# EAGLE design unoplustest (EAGLE 9.6.2)
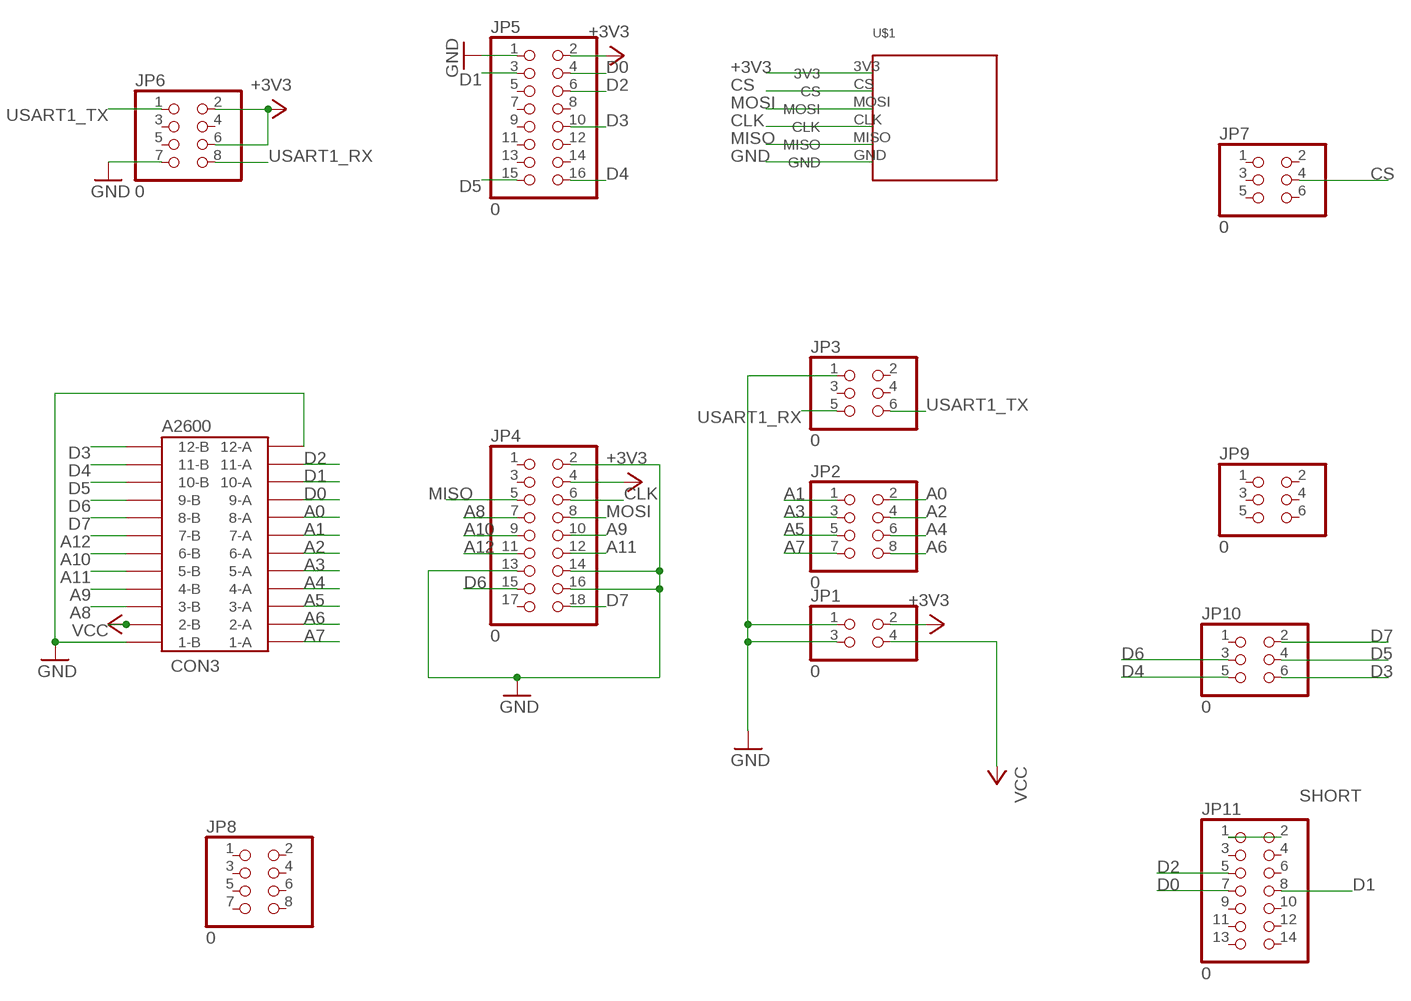
[diagram p0: schematic, sheet 1]

## Parts
CON3  A2600  24PINEDGE-254MM  [24PINEDGE-254MM]
JP1  0  PINHD-2X2  [2X02]
JP2  0  PINHD-2X4  [2X04]
JP3  0  PINHD-2X3  [2X03]
JP4  0  PINHD-2X9  [2X09]
JP5  0  PINHD-2X8  [2X08]
JP6  0  PINHD-2X4  [2X04]
JP7  0  PINHD-2X3  [2X03]
JP8  0  PINHD-2X4  [2X04]
JP9  0  PINHD-2X3  [2X03]
JP10  0  PINHD-2X3  [2X03]
JP11  0  PINHD-2X7  [2X07]
U$1  MICROSD2MICROSD2  [MICROSD_FOOTPRINT]

## Nets
+3V3: JP1.2 JP4.4 JP5.2 JP6.2 JP6.6 U$1.3V3
A0: CON3.8-A JP2.2
A1: CON3.7-A JP2.1
A2: CON3.6-A JP2.4
A3: CON3.5-A JP2.3
A4: CON3.4-A JP2.6
A5: CON3.3-A JP2.5
A6: CON3.2-A JP2.8
A7: CON3.1-A JP2.7
A8: CON3.3-B JP4.7
A9: CON3.4-B JP4.10
A10: CON3.6-B JP4.9
A11: CON3.5-B JP4.12
A12: CON3.7-B JP4.11
CLK: JP4.6 U$1.CLK
CS: JP7.4 U$1.CS
D0: CON3.9-A JP5.4 JP11.7
D1: CON3.10-A JP5.3 JP11.8
D2: CON3.11-A JP5.6 JP11.5
D3: CON3.12-B JP5.10 JP10.6
D4: CON3.11-B JP5.16 JP10.5
D5: CON3.10-B JP5.15 JP10.4
D6: CON3.9-B JP4.15 JP10.3
D7: CON3.8-B JP4.18 JP10.2
GND: CON3.1-B CON3.12-A JP1.1 JP1.3 JP3.1 JP4.2 JP4.13 JP4.14 JP4.16 JP5.1 JP6.7 U$1.GND
MISO: JP4.5 U$1.MISO
MOSI: JP4.8 U$1.MOSI
SHORT: JP11.1 JP11.2
USART1_RX: JP3.5 JP6.8
USART1_TX: JP3.6 JP6.1
VCC: CON3.2-B JP1.4
Unconnected: JP3.2 JP3.3 JP3.4 JP4.1 JP4.3 JP4.17 JP5.5 JP5.7 JP5.8 JP5.9 JP5.11 JP5.12 JP5.13 JP5.14 JP6.3 JP6.4 JP6.5 JP7.1 JP7.2 JP7.3 JP7.5 JP7.6 JP8.1 JP8.2 JP8.3 JP8.4 JP8.5 JP8.6 JP8.7 JP8.8 JP9.1 JP9.2 JP9.3 JP9.4 JP9.5 JP9.6 JP10.1 JP11.3 JP11.4 JP11.6 JP11.9 JP11.10 JP11.11 JP11.12 JP11.13 JP11.14

## Library data of the parts
CON3 = con-edge:24PINEDGE-254MM: 24 PIN EDGE CONNECTOR 2.54mm ATARI 2600 CARTRIDGE PORT
JP1 = pinhead:PINHD-2X2: PIN HEADER
JP2 JP6 JP8 = pinhead:PINHD-2X4: PIN HEADER
JP3 JP7 JP9 JP10 = pinhead:PINHD-2X3: PIN HEADER
JP4 = pinhead:PINHD-2X9: PIN HEADER
JP5 = pinhead:PINHD-2X8: PIN HEADER
JP11 = pinhead:PINHD-2X7: PIN HEADER
U$1 = MICROSD:MICROSD2

## Board
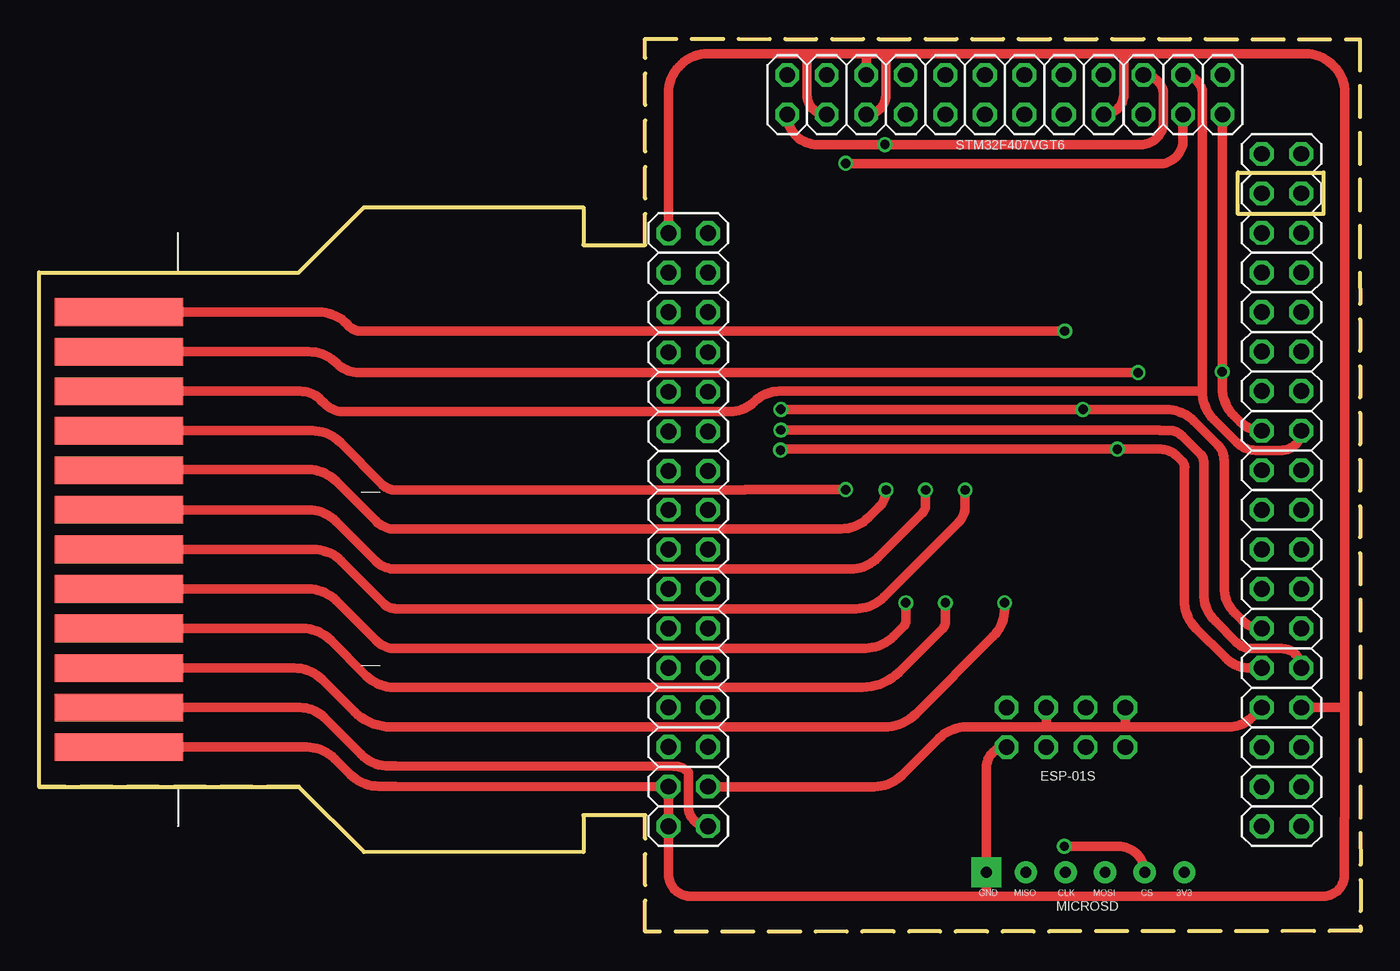
[diagram p1: board, top side]
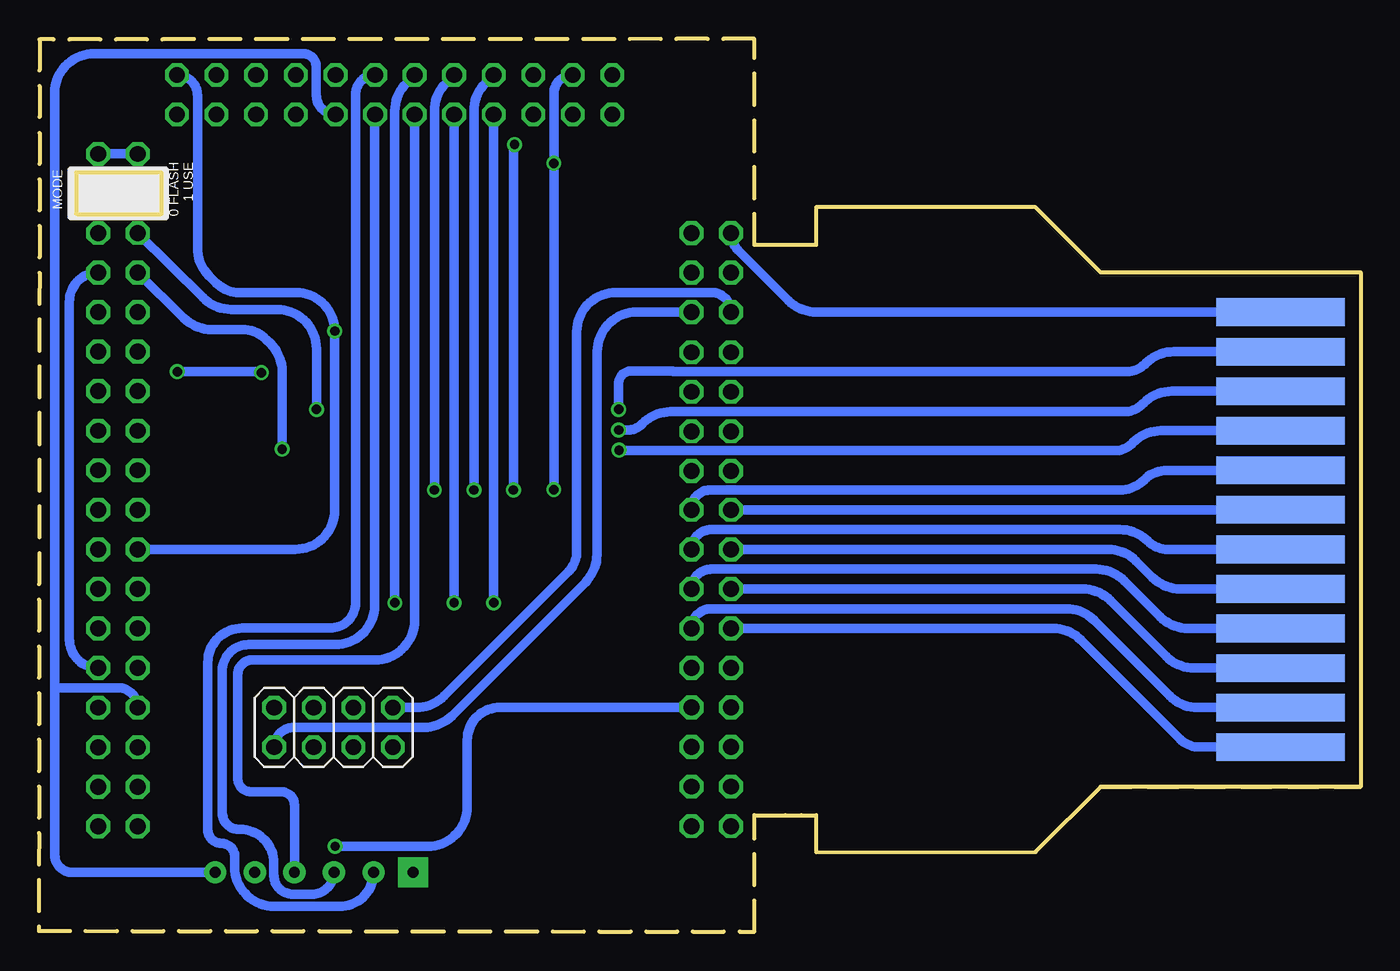
[diagram p2: board, bottom side, seen from below]

Size 84.89 x 57.35 mm. Coordinates in mm from the lower left corner, seen from the top.
Outline: 38.94,7.49 34.98,7.49
Outline: 34.98,7.49 34.98,5.11 20.88,5.13 16.69,9.32
Outline: 0,9.32 0,42.34 16.69,42.34 20.88,46.53 34.98,46.53 34.98,44.12 38.94,44.12 38.94,57.35 84.84,57.33 84.89,0.05 38.94,0 38.94,7.49
Outline: 0,9.32 16.69,9.32
Outline: 38.94,7.49 34.98,7.49
Outline: 16.69,9.32 0,9.32
Copper layers (1*16): Top 0.0356mm / dielectric 1.5011mm / Bottom 0.0356mm
Design rules "OSHPark2layer": minimum track width 6mil, minimum drill 13mil, track to track 6mil, track to pad 6mil, pad to pad 6mil, via to via 6mil, smd to smd 6mil, copper to edge 15mil, drill to drill 6mil, minimum pad ring 7mil, minimum via ring 7mil, stop-mask expansion 3mil, vias tented up to drill 0mil, thermal gap 10mil
tRestrict: area 74.5,2.2 to 74.5,8.7
Milling: 4 lines

### Footprints (pad centres in the part's own frame; a part is rotated, then mirrored left to right if it is on the bottom)
24PINEDGE-254MM = smd 1.778 x 8.255: 1-A -22.86,-7.62; 2-A -20.32,-7.62; 3-A -17.78,-7.62; 4-A -15.24,-7.62; 5-A -12.7,-7.62; 6-A -10.16,-7.62; 7-A -7.62,-7.62; 8-A -5.08,-7.62; 9-A -2.54,-7.62; 10-A 0,-7.62; 11-A 2.54,-7.62; 12-A 5.08,-7.62 | smd 1.778 x 8.255 bottom: 1-B -22.86,-7.62; 2-B -20.32,-7.62; 3-B -17.78,-7.62; 4-B -15.24,-7.62; 5-B -12.7,-7.62; 6-B -10.16,-7.62; 7-B -7.62,-7.62; 8-B -5.08,-7.62; 9-B -2.54,-7.62; 10-B 0,-7.62; 11-B 2.54,-7.62; 12-B 5.08,-7.62
2X02 = drill 1.016 octagon: 1 -1.27,-1.27; 2 -1.27,1.27; 3 1.27,-1.27; 4 1.27,1.27
2X04 = drill 1.016 octagon: 1 -3.81,-1.27; 2 -3.81,1.27; 3 -1.27,-1.27; 4 -1.27,1.27; 5 1.27,-1.27; 6 1.27,1.27; 7 3.81,-1.27; 8 3.81,1.27
2X03 = drill 1.016 octagon: 1 -2.54,-1.27; 2 -2.54,1.27; 3 0,-1.27; 4 0,1.27; 5 2.54,-1.27; 6 2.54,1.27
2X09 = drill 1.016 octagon: 1 -10.16,-1.27; 2 -10.16,1.27; 3 -7.62,-1.27; 4 -7.62,1.27; 5 -5.08,-1.27; 6 -5.08,1.27; 7 -2.54,-1.27; 8 -2.54,1.27; 9 0,-1.27; 10 0,1.27; 11 2.54,-1.27; 12 2.54,1.27; 13 5.08,-1.27; 14 5.08,1.27; 15 7.62,-1.27; 16 7.62,1.27; 17 10.16,-1.27; 18 10.16,1.27
2X08 = drill 1.016 octagon: 1 -8.89,-1.27; 2 -8.89,1.27; 3 -6.35,-1.27; 4 -6.35,1.27; 5 -3.81,-1.27; 6 -3.81,1.27; 7 -1.27,-1.27; 8 -1.27,1.27; 9 1.27,-1.27; 10 1.27,1.27; 11 3.81,-1.27; 12 3.81,1.27; 13 6.35,-1.27; 14 6.35,1.27; 15 8.89,-1.27; 16 8.89,1.27
2X07 = drill 1.016 octagon: 1 -7.62,-1.27; 2 -7.62,1.27; 3 -5.08,-1.27; 4 -5.08,1.27; 5 -2.54,-1.27; 6 -2.54,1.27; 7 0,-1.27; 8 0,1.27; 9 2.54,-1.27; 10 2.54,1.27; 11 5.08,-1.27; 12 5.08,1.27; 13 7.62,-1.27; 14 7.62,1.27
MICROSD_FOOTPRINT = drill 0.7 pad 1.422: 3V3 -13.97,6.35; CLK -13.97,-1.27; CS -13.97,3.81; MISO -13.97,-3.81; MOSI -13.97,1.27 | drill 0.7 pad 1.93 square: GND -13.97,-6.35

### Placement (x,y rotation side)
CON3  12.75,34.72 90 bottom
JP1  41.71,8.05 270 top
JP2  41.71,23.29 270 top
JP3  41.71,42.34 270 top
JP4  58.22,53.77 180 top
JP5  79.81,23.29 90 top
JP6  65.96,13.13 0 bottom
JP7  41.71,14.41 270 top
JP8  41.71,33.41 270 top
JP9  79.81,9.31 270 top
JP10  73.48,53.77 0 top
JP11  79.81,42.35 270 top
U$1  67.21,-10.16 270 top

### Tracks (layer width: path | path; a pad name or v marks a point on that pad's centre or on a via)
+3V3
  Top 0.61: JP1.2 53.66,9.32 arc45 55.44,10.06 57.8,12.41 arc-45 59.59,13.16 64.67,13.16 | 64.67,13.16 69.77,13.16 | 69.77,13.16 76.43,13.16 arc45 77.9,13.77 JP5.2 | JP6.2 69.77,13.16 | JP6.6 64.69,13.22 arc-45 64.67,13.16
  Bottom 0.61: JP4.4 arc90 67.07,53.73 67.07,55.55 arc-90 67.94,56.42 81.33,56.42 arc-90 83.87,53.88 83.87,15.67 | 83.87,15.67 83.87,10.42 arc90 83.87,10.41 83.87,4.95 arc-90 82.73,3.81 U$1.3V3 | JP5.2 arc-90 79.81,15.67 83.87,15.67
A0
  Bottom 0.61: JP2.2 42.98,27.17 arc90 41.77,28.38 15.47,28.38 arc-45 13.89,29.03 arc45 12.42,29.64 CON3.8-A
A1
  Bottom 0.61: JP2.1 CON3.7-A
A2
  Bottom 0.61: JP2.4 arc90 41.71,25.83 15.45,25.83 arc45 13.66,25.09 arc-45 12.39,24.56 CON3.6-A
A3
  Bottom 0.61: JP2.3 16.22,24.56 arc45 14.42,23.82 13.37,22.77 arc-45 11.57,22.02 CON3.5-A
A4
  Bottom 0.61: JP2.6 arc90 41.71,23.29 16.98,23.29 arc45 15.18,22.55 12.86,20.23 arc-45 11.06,19.48 CON3.4-A
A5
  Bottom 0.61: JP2.5 17.87,22.02 arc45 16.07,21.28 12.48,17.69 arc-45 10.68,16.94 CON3.3-A
A6
  Bottom 0.61: JP2.8 arc90 41.71,20.75 18.91,20.75 arc45 17.11,20.01 12.25,15.15 arc-45 10.45,14.4 CON3.2-A
A7
  Bottom 0.61: JP2.7 19.75,19.48 arc45 17.95,18.74 11.58,12.37 arc-45 10.36,11.86 CON3.1-A
A8  (via drill 0.6)
  Top 0.61: CON3.3-B 16.4,16.94 arc-45 18.19,16.2 20.26,14.13 arc45 22.6,13.16 54.28,13.16 arc45 56.32,14 61.28,18.97 arc45 62.03,20.76 v62.03,21.13
  Bottom 0.61: JP4.7 61.28,54.52 arc-45 62.03,52.72 v62.03,21.13
A9  (via drill 0.6)
  Top 0.61: v58.22,21.13 58.22,19.89 arc-45 58.05,19.5 55.23,16.67 arc-45 52.89,15.7 22.91,15.7 22.82,15.7 arc-45 21.02,16.44 18.73,18.74 arc45 16.93,19.48 CON3.4-B
  Bottom 0.61: JP4.10 v58.22,21.13
A10  (via drill 0.6)
  Top 0.61: v59.49,28.37 59.49,27.33 arc-45 59.06,26.29 54.26,21.5 arc-45 52.47,20.75 22.91,20.75 arc-45 22.17,21.06 19.41,23.82 arc45 17.62,24.56 CON3.6-B
  Bottom 0.61: JP4.9 58.74,54.52 arc-45 59.49,52.72 v59.49,28.37
A11  (via drill 0.6)
  Top 0.61: v55.68,21.13 55.68,19.94 arc-45 55.55,19.64 54.87,18.96 arc-45 53.07,18.21 22.97,18.21 arc45 22.91,18.19 arc-45 21.65,18.71 19.08,21.28 arc45 17.29,22.02 16.7,22.02 CON3.5-B
  Bottom 0.61: JP4.12 v55.68,21.13
A12  (via drill 0.6)
  Top 0.61: v56.95,28.37 56.95,27.38 arc-45 56.75,26.9 53.88,24.04 arc-45 52.08,23.29 22.91,23.29 arc-45 21.61,23.83 19.08,26.36 arc45 17.29,27.1 16.71,27.1 CON3.7-B
  Bottom 0.61: JP4.11 56.2,54.52 arc-45 56.95,52.72 v56.95,28.37
CLK
  Bottom 0.61: JP4.6 arc-45 63.32,52.45 63.32,20.99 arc90 65.86,18.45 71.42,18.45 arc-90 73.11,16.76 73.11,7.63 arc-90 72.06,6.58 71.96,6.58 arc90 69.8,4.42 69.8,3.63 arc-90 68.58,2.41 67.34,2.41 arc-90 U$1.CLK
CS  (via drill 0.6)
  Top 0.61: v65.86,5.49 69.34,5.49 arc-90 U$1.CS
  Bottom 0.61: JP7.4 55.28,14.41 arc-90 57.38,12.31 57.38,8.03 arc90 59.92,5.49 v65.86,5.49
D0  (via drill 0.6)
  Top 0.61: v47.62,30.94 47.68,31 v69.27,31 72.05,31 arc-45 73.05,30.58 73.44,30.19 arc-45 73.58,29.84 arc45 73.56,29.78 73.56,21.3 arc45 74.3,19.5 76.23,17.58 arc45 77.76,16.94 JP5.4
  Bottom 0.61: v47.62,30.94 47.59,30.9 15.77,30.9 arc-45 14.71,31.34 14.61,31.44 arc45 12.82,32.18 CON3.9-A | v69.27,31 69.27,35.98 arc-45 70.01,37.78 70.28,38.05 arc-45 71.81,38.68 73.79,38.68 arc45 75.58,39.43 JP11.7
D1  (via drill 0.6)
  Top 0.61: JP5.3 arc90 79.83,18.19 77.9,18.19 arc-45 76.9,18.6 75.55,19.96 arc-45 74.8,21.75 74.8,30.23 arc45 74.62,30.66 73.43,31.85 arc45 72.57,32.21 72.01,32.21 arc-45 71.95,32.23 v47.65,32.23
  Bottom 0.61: JP5.3 arc90 82.93,18.79 82.93,40.46 arc90 JP11.8 | CON3.10-A 12.13,34.72 arc-45 13.93,33.98 14.02,33.88 arc45 15.19,33.4 44.31,33.4 arc-45 46.11,32.66 46.18,32.59 arc45 47.04,32.23 v47.65,32.23
D2  (via drill 0.6)
  Top 0.61: v47.65,33.55 v67.06,33.55 72.38,33.55 arc-45 74.18,32.81 75.72,31.27 arc-45 76.12,30.29 76.12,22.13 arc45 76.81,20.47 77.28,20 arc45 JP5.6
  Bottom 0.61: JP11.5 74.34,40.72 arc-45 72.54,39.98 69.6,39.98 arc90 67.06,37.44 v67.06,33.55 | v47.65,33.55 47.65,35.23 arc90 46.86,36.02 44.18,36.02 arc90 44.16,35.99 14.97,35.99 arc-45 13.87,36.45 13.8,36.52 arc45 12,37.26 CON3.11-A
D3  (via drill 0.6)
  Top 0.61: v65.89,38.58 20.67,38.58 arc-45 19.94,38.89 19.77,39.06 arc45 17.97,39.8 CON3.12-B
  Bottom 0.61: JP5.10 68.42,24.56 arc-90 65.88,27.1 65.88,38.56 arc-45 v65.89,38.58 arc-90 68.36,41.06 72.03,41.06 arc45 73.49,41.66 73.96,42.13 arc45 74.7,43.93 74.7,53.71 arc-90 JP10.6
D4  (via drill 0.6)
  Top 0.61: JP5.16 arc-45 77.15,32.76 76.74,33.16 arc-45 76,34.96 v76,35.98 arc45 76.02,36.03 JP10.5 | v70.6,35.91 23.04,35.91 20.58,35.91 arc-45 19.15,36.5 19.13,36.52 arc45 17.34,37.26 CON3.11-B
  Bottom 0.61: v70.6,35.91 arc-45 70.77,35.98 v76,35.98
D5
  Top 0.61: JP5.15 arc-90 79.82,30.93 78.16,30.93 arc-45 76.95,31.43 75.46,32.92 arc-45 74.71,34.71 74.71,34.72 | JP10.4 arc-90 74.73,53.79 74.73,34.74 arc-90 74.71,34.72 | 74.71,34.72 47.58,34.72 arc45 45.92,34.04 arc-45 44.39,33.4 20.98,33.4 20.65,33.4 19.63,33.4 arc-45 18.34,33.93 18.11,34.16 arc45 16.76,34.72 CON3.10-B
D6  (via drill 0.6)
  Top 0.61: v51.82,28.4 45.39,28.4 45.36,28.37 22.91,28.37 arc-45 22.09,28.71 19.36,31.44 arc45 17.57,32.18 CON3.9-B | JP10.3 73.48,50.86 arc-90 71.95,49.33 51.86,49.33 arc-90 v51.82,49.37
  Bottom 0.61: v51.82,28.4 v51.82,49.37 51.82,53.82 arc90 JP4.15
D7  (via drill 0.6)
  Top 0.61: v54.41,28.37 arc-45 53.96,27.29 53.29,26.62 arc-45 51.51,25.88 22.97,25.88 arc45 22.91,25.86 arc-45 21.65,26.38 19.08,28.95 arc45 17.29,29.69 16.76,29.69 16.38,29.69 5.25,29.69 arc45 CON3.8-B | JP4.18 arc90 49.99,50.57 v54.34,50.57 70.76,50.57 arc90 72.23,52.04 72.23,53.75 arc90 JP10.2
  Bottom 0.61: v54.41,28.37 54.41,50.5 arc-90 v54.34,50.57
GND
  Top 0.61: 83.87,14.5 83.87,7.31 arc90 83.85,7.28 83.85,3.63 arc-90 82.5,2.29 60.71,2.29 | JP5.1 83.77,14.4 arc90 83.87,14.5 | 83.87,14.5 83.87,53.87 arc90 81.33,56.41 69.68,56.41 | 69.68,56.41 54.41,56.41 | 54.41,56.41 53.19,56.41 | JP4.2 arc90 69.68,53.8 69.68,56.41 | JP3.1 40.44,53.87 arc-90 42.98,56.41 49.33,56.41 | 49.33,56.41 53.19,56.41 | JP4.13 53.14,56.35 arc-90 53.19,56.41 | JP4.16 arc-90 49.33,53.77 49.33,56.41 | JP4.14 arc90 54.41,53.77 54.41,56.41 | CON3.1-B 17.18,11.86 arc-45 18.98,11.12 20.01,10.09 arc45 21.8,9.35 22.91,9.35 JP1.1 JP1.3 40.44,3.68 arc90 41.83,2.29 60.71,2.29 | JP6.7 arc90 60.86,10.57 U$1.GND 60.86,2.44 arc-90 60.71,2.29
  Bottom 0.61: JP3.1 arc-45 39.99,43.8 36.74,40.55 arc-45 34.94,39.8 CON3.12-A
MISO
  Bottom 0.61: JP4.5 arc-90 64.55,53.79 64.55,21.15 arc90 66.19,19.51 71.84,19.51 arc-90 74.04,17.31 74.04,10.01 arc90 74.04,10.01 74.04,6.56 arc-90 73.18,5.69 arc90 72.31,4.83 72.31,4.17 arc-90 69.77,1.63 65.58,1.63 arc-90 U$1.MISO
MOSI
  Bottom 0.61: JP4.8 60.76,20.01 arc90 63.3,17.47 71.17,17.47 arc-90 72.12,16.52 72.12,9.84 arc-90 71.27,8.99 69.32,8.99 arc90 68.48,8.15 U$1.MOSI
SHORT
  Bottom 0.61: JP11.1 JP11.2
USART1_RX
  Bottom 0.61: JP3.5 arc-90 41.71,41.07 47.8,41.07 arc-90 50.34,38.53 50.34,24.43 arc45 50.88,23.13 58.87,15.15 arc45 60.67,14.4 JP6.8
USART1_TX
  Bottom 0.61: JP6.1 arc90 68.5,13.13 60.16,13.13 arc-45 58.36,13.88 49.79,22.45 arc-45 49.05,24.24 arc-45 49.03,24.28 49.03,37.26 arc90 46.49,39.8 JP3.6
VCC
  Top 0.61: JP1.4 arc-90 41.71,8.05 arc45 41.71,8.05 41.71,10.25 arc45 40.77,10.64 22.91,10.64 22.49,10.64 arc-45 20.69,11.39 18.32,13.75 arc45 16.76,14.4 CON3.2-B

### Text on the board
tNames: STM32F407VGT6 | ESP-01S | MICROSD
bNames: 0 FLASH / 1 USE | MODE
200bmp: /Users/boo/Documents/plus.bmp